# Altium schematic sheet Main.SchDoc: Main
size A3; CompanyName: Novelda AS; Organization: Novelda AS; Address1: Gjerdrums vei 8; Address2: NO-0484 Oslo; Address3: Norway; Revision: 1.A; SheetNumber: 1; SheetTotal: 1; Classification: Classification; Size: A3; Project: Project; ProjectName: Prosject Name
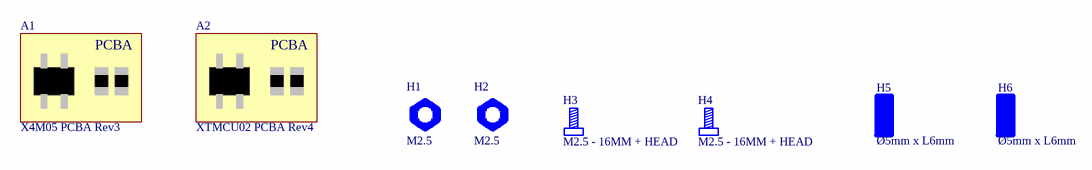
[diagram p0: Main.SchDoc]

## Parts
A1  X4M05 PCBA Rev3  [280040-003]
A2  XTMCU02 PCBA Rev4  [280027-004]
H1  M2.5  [200192]
H2  M2.5  [200192]
H3  M2.5 - 16MM + HEAD  [200331]
H4  M2.5 - 16MM + HEAD  [200331]
H5  Ø5mm x L6mm  [200332]
H6  Ø5mm x L6mm  [200332]

## Notes on the sheet
- Size:
- Date:
- ItemNo:
- Sheet:
- of
- Title:
- Project:
- Classification:
- Copyright © 2017 Novelda AS
- (in symbol 280027-004) PCBA
- (in symbol 280040-003) PCBA

## Library data of the parts
A1 = 280040-003: Manufacturer: Novelda; Component Status: New; ItemNo: 280040-003; Value: X4M05 PCBA Rev3; MPN: 280040-003; ClassName: -; Notes: -
A2 = 280027-004: Manufacturer: Novelda; Component Status: Active; ItemNo: 280027-004; Value: XTMCU02 PCBA Rev4; MPN: 280027-004; ClassName: -; Notes: -
H1 H2 = 200192: HEX NUT, M2.5,  PLASTIC; Component Status: New; Component Category: Misc; ItemNo: 200192; Value: M2.5; Manufacturer: --; Supplier: Farnell Norge; SupplierCatNo: 2494506; ClassName: -; Notes: -
H3 H4 = 200331: SLOTTED MACHINE SCREW, M2.5, 16MM LENGTH BELOW HEAD, PLASTIC; Component Status: New; Component Category: Misc; ItemNo: 200331; Value: M2.5 - 16MM + HEAD; Manufacturer: --; Supplier: Farnell Norge; SupplierCatNo: 2472700; ClassName: -; Notes: -
H5 H6 = 200332: FEMALE SPACER, Ø5MM O/D, 6MM LENGTH, PLASTIC; Component Status: New; Component Category: Misc; ItemNo: 200332; Value: Ø5mm x L6mm; Manufacturer: --; Supplier: Farnell Norge; SupplierCatNo: 1651703; ClassName: -; Notes: -